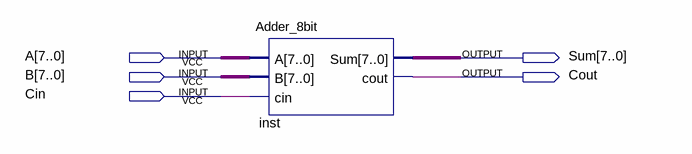
[diagram p0: schematic sheet]
// Quartus schematic lab4-adder_8bit.bdf as structural Verilog: 1 symbols, 5 pins
module \lab4-adder_8bit  (
  input  [7:0] A,
  input  [7:0] B,
  input  Cin,
  output [7:0] Sum,
  output Cout
);

  Adder_8bit inst (.A(A), .B(B), .cin(Cin), .Sum(Sum), .cout(Cout));
endmodule
